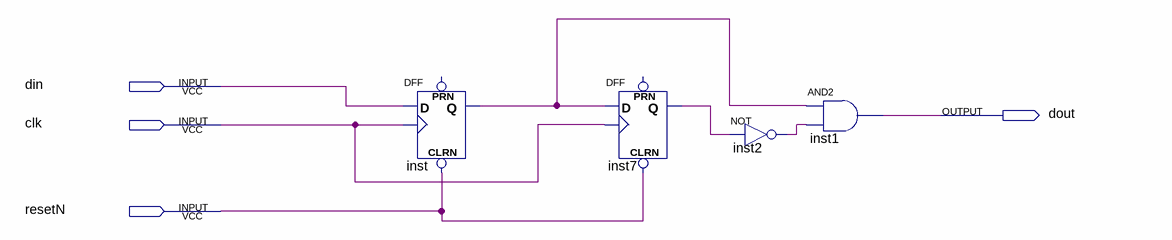
[diagram p0: schematic sheet]
// Quartus schematic gozer_up.bdf as structural Verilog: 4 symbols, 4 pins
module gozer_up (
  input  din,
  input  clk,
  input  resetN,
  output dout
);

  wire inst2_out, inst7_q, inst_q;

  DFF inst (.CLRN(resetN), .CLK(clk), .D(din), .Q(inst_q));  // open: PRN
  DFF inst7 (.CLRN(resetN), .CLK(clk), .D(inst_q), .Q(inst7_q));  // open: PRN
  not inst2 (inst2_out, inst7_q);
  and inst1 (dout, inst_q, inst2_out);
endmodule
